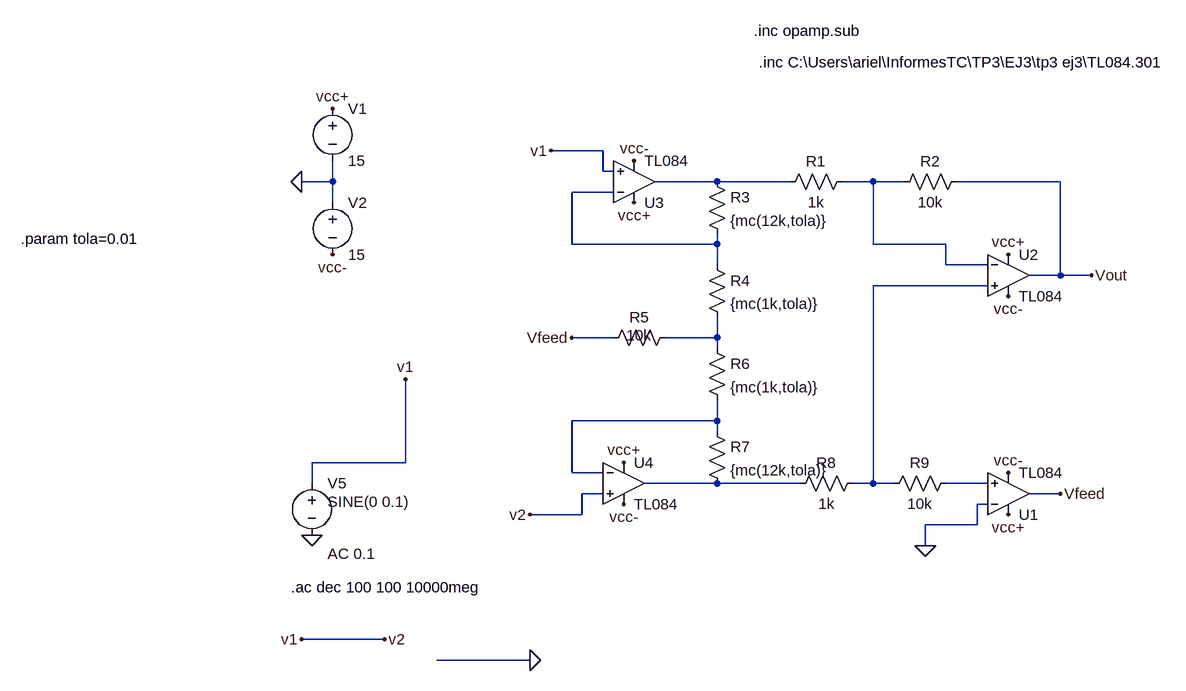
[diagram p0: schematic final.asc]
final.asc, the LTspice schematic file:
Version 4
SHEET 1 1128 972
WIRE 32 96 -48 96
WIRE 32 128 32 96
WIRE 48 128 32 128
WIRE -384 144 -384 112
WIRE -384 144 -432 144
WIRE 208 144 112 144
WIRE 320 144 208 144
WIRE 448 144 400 144
WIRE 496 144 448 144
WIRE 736 144 576 144
WIRE 48 160 -16 160
WIRE -384 176 -384 144
WIRE -16 240 -16 160
WIRE 208 240 208 224
WIRE 208 240 -16 240
WIRE 448 240 448 144
WIRE 560 240 448 240
WIRE 208 272 208 240
WIRE 560 272 560 240
WIRE 624 272 560 272
WIRE 736 288 736 144
WIRE 736 288 688 288
WIRE 784 288 736 288
WIRE 624 304 448 304
WIRE 48 384 -16 384
WIRE 208 384 208 352
WIRE 208 384 128 384
WIRE 208 400 208 384
WIRE 208 512 208 480
WIRE 208 512 -16 512
WIRE 208 528 208 512
WIRE -272 576 -272 448
WIRE -272 576 -416 576
WIRE -16 592 -16 512
WIRE 32 592 -16 592
WIRE -416 608 -416 576
WIRE 208 608 96 608
WIRE 336 608 208 608
WIRE 448 608 448 304
WIRE 448 608 416 608
WIRE 480 608 448 608
WIRE 624 608 560 608
WIRE 32 624 0 624
WIRE 736 624 688 624
WIRE 624 640 608 640
WIRE 0 656 0 624
WIRE 0 656 -80 656
WIRE 608 672 608 640
WIRE 608 672 528 672
WIRE 528 704 528 672
WIRE -304 848 -432 848
WIRE -80 880 -224 880
FLAG -16 384 Vfeed
FLAG 736 624 Vfeed
FLAG -416 688 0
FLAG -272 448 v1
FLAG -48 96 v1
FLAG -80 656 v2
FLAG 784 288 Vout
FLAG -432 144 0
FLAG -384 32 vcc+
FLAG -384 256 vcc-
FLAG 656 656 vcc+
FLAG 656 592 vcc-
FLAG 64 576 vcc+
FLAG 80 176 vcc+
FLAG 656 256 vcc+
FLAG 80 112 vcc-
FLAG 656 320 vcc-
FLAG 64 640 vcc-
FLAG 528 704 0
FLAG -80 880 0
FLAG -432 848 v1
FLAG -304 848 v2
SYMBOL res 192 128 R0
SYMATTR InstName R3
SYMATTR Value {mc(12k,tola)}
SYMBOL res 192 256 R0
SYMATTR InstName R4
SYMATTR Value {mc(1k,tola)}
SYMBOL res 192 384 R0
SYMATTR InstName R6
SYMATTR Value {mc(1k,tola)}
SYMBOL res 192 512 R0
SYMATTR InstName R7
SYMATTR Value {mc(12k,tola)}
SYMBOL res 416 128 R90
WINDOW 0 0 56 VBottom 2
WINDOW 3 32 56 VTop 2
SYMATTR InstName R1
SYMATTR Value 1k
SYMBOL res 592 128 R90
WINDOW 0 0 56 VBottom 2
WINDOW 3 32 56 VTop 2
SYMATTR InstName R2
SYMATTR Value 10k
SYMBOL res 432 592 R90
WINDOW 0 0 56 VBottom 2
WINDOW 3 32 56 VTop 2
SYMATTR InstName R8
SYMATTR Value 1k
SYMBOL res 576 592 R90
WINDOW 0 0 56 VBottom 2
WINDOW 3 32 56 VTop 2
SYMATTR InstName R9
SYMATTR Value 10k
SYMBOL res 144 368 R90
WINDOW 0 0 56 VBottom 2
WINDOW 3 28 56 VBottom 2
SYMATTR InstName R5
SYMATTR Value 10k
SYMBOL voltage -416 592 R0
WINDOW 123 24 124 Left 2
WINDOW 39 0 0 Left 2
WINDOW 3 24 44 Left 2
SYMATTR Value2 AC 0.1
SYMATTR Value SINE(0 0.1)
SYMATTR InstName V5
SYMBOL voltage -384 16 R0
WINDOW 123 0 0 Left 2
WINDOW 39 0 0 Left 2
SYMATTR InstName V1
SYMATTR Value 15
SYMBOL voltage -384 160 R0
WINDOW 123 0 0 Left 2
WINDOW 39 0 0 Left 2
SYMATTR InstName V2
SYMATTR Value 15
SYMBOL Opamps\\opamp2 656 688 M180
SYMATTR InstName U1
SYMATTR Value TL084
SYMBOL Opamps\\opamp2 656 224 R0
SYMATTR InstName U2
SYMATTR Value TL084
SYMBOL Opamps\\opamp2 80 208 M180
SYMATTR InstName U3
SYMATTR Value TL084
SYMBOL Opamps\\opamp2 64 544 R0
SYMATTR InstName U4
SYMATTR Value TL084
TEXT -448 768 Left 2 !.ac dec 100 100 10000meg
TEXT 264 -88 Left 2 !.inc opamp.sub
TEXT 272 -40 Left 2 !.inc C:\\Users\\ariel\\InformesTC\\TP3\\EJ3\\tp3 ej3\\TL084.301
TEXT -864 232 Left 2 !.param tola=0.01

The netlist it stands for:
* final.asc
R3 N001 N003 {mc(12k,tola)}
R4 N003 N005 {mc(1k,tola)}
R6 N005 N006 {mc(1k,tola)}
R7 N006 N007 {mc(12k,tola)}
R1 N002 N001 1k
R2 Vout N002 10k
R8 N004 N007 1k
R9 N008 N004 10k
R5 N005 Vfeed 10k
V5 v2 0 SINE(0 0.1) AC 0.1
V1 vcc+ 0 15
V2 0 vcc- 15
XU1 N008 0 vcc+ vcc- Vfeed TL084  ; pins In+ In- V+ V- OUT
XU2 N004 N002 vcc+ vcc- Vout TL084  ; pins In+ In- V+ V- OUT
XU3 v2 N003 vcc+ vcc- N001 TL084  ; pins In+ In- V+ V- OUT
XU4 v2 N006 vcc+ vcc- N007 TL084  ; pins In+ In- V+ V- OUT
.ac dec 100 100 10000meg
.inc opamp.sub
.inc C:\Users\ariel\InformesTC\TP3\EJ3\tp3 ej3\TL084.301
.param tola=0.01
.backanno
.end